# Altium project suntile.PrjPCB
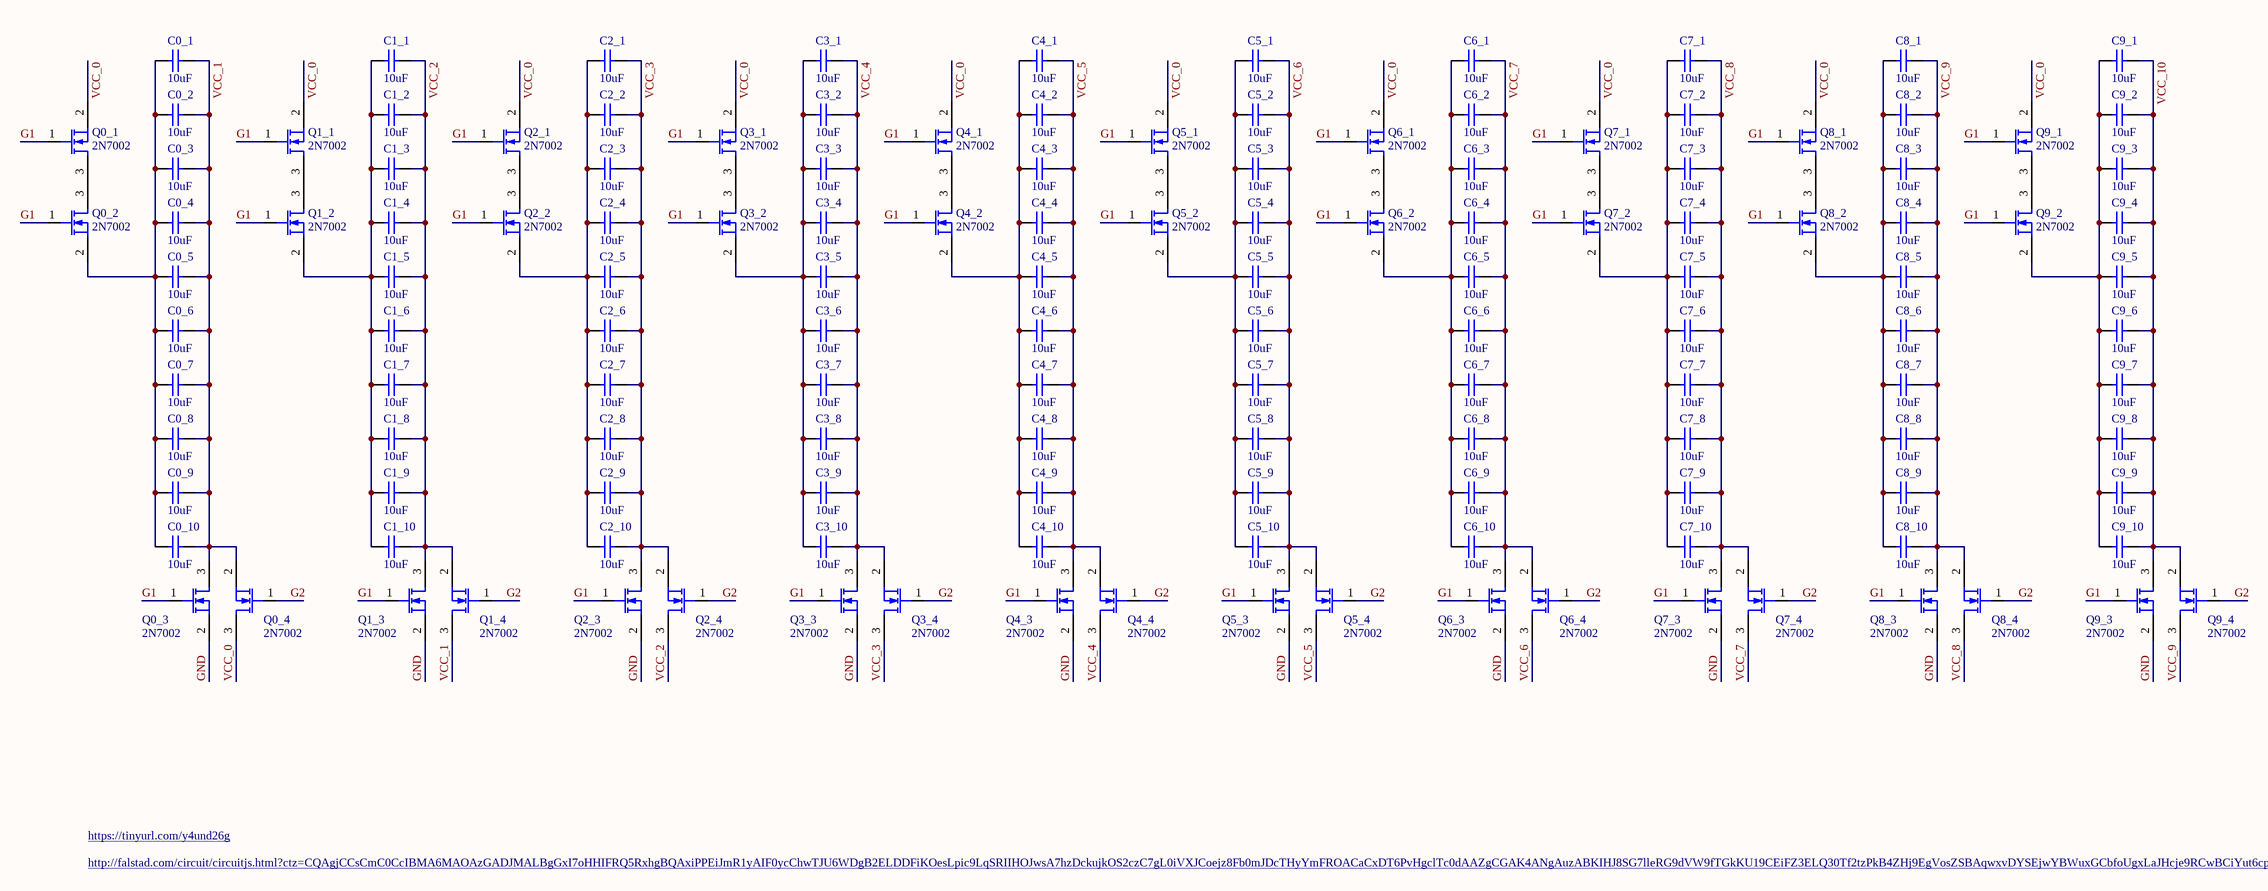
[diagram p0: suntile.SchDoc]
1 sheet, 140 parts. Net scope: global (net labels, ports and power ports of the same name join across sheets).
Board file: suntile.PcbDoc

## Sheet suntile.SchDoc
size C

### Parts
C0_1  value 10uF  [C_0402]  (hidden comment: CL05A106MQ5NUNC)
C0_2  value 10uF  [C_0402]  (hidden comment: CL05A106MQ5NUNC)
C0_3  value 10uF  [C_0402]  (hidden comment: CL05A106MQ5NUNC)
C0_4  value 10uF  [C_0402]  (hidden comment: CL05A106MQ5NUNC)
C0_5  value 10uF  [C_0402]  (hidden comment: CL05A106MQ5NUNC)
C0_6  value 10uF  [C_0402]  (hidden comment: CL05A106MQ5NUNC)
C0_7  value 10uF  [C_0402]  (hidden comment: CL05A106MQ5NUNC)
C0_8  value 10uF  [C_0402]  (hidden comment: CL05A106MQ5NUNC)
C0_9  value 10uF  [C_0402]  (hidden comment: CL05A106MQ5NUNC)
C0_10  value 10uF  [C_0402]  (hidden comment: CL05A106MQ5NUNC)
C1_1  value 10uF  [C_0402]  (hidden comment: CL05A106MQ5NUNC)
C1_2  value 10uF  [C_0402]  (hidden comment: CL05A106MQ5NUNC)
C1_3  value 10uF  [C_0402]  (hidden comment: CL05A106MQ5NUNC)
C1_4  value 10uF  [C_0402]  (hidden comment: CL05A106MQ5NUNC)
C1_5  value 10uF  [C_0402]  (hidden comment: CL05A106MQ5NUNC)
C1_6  value 10uF  [C_0402]  (hidden comment: CL05A106MQ5NUNC)
C1_7  value 10uF  [C_0402]  (hidden comment: CL05A106MQ5NUNC)
C1_8  value 10uF  [C_0402]  (hidden comment: CL05A106MQ5NUNC)
C1_9  value 10uF  [C_0402]  (hidden comment: CL05A106MQ5NUNC)
C1_10  value 10uF  [C_0402]  (hidden comment: CL05A106MQ5NUNC)
C2_1  value 10uF  [C_0402]  (hidden comment: CL05A106MQ5NUNC)
C2_2  value 10uF  [C_0402]  (hidden comment: CL05A106MQ5NUNC)
C2_3  value 10uF  [C_0402]  (hidden comment: CL05A106MQ5NUNC)
C2_4  value 10uF  [C_0402]  (hidden comment: CL05A106MQ5NUNC)
C2_5  value 10uF  [C_0402]  (hidden comment: CL05A106MQ5NUNC)
C2_6  value 10uF  [C_0402]  (hidden comment: CL05A106MQ5NUNC)
C2_7  value 10uF  [C_0402]  (hidden comment: CL05A106MQ5NUNC)
C2_8  value 10uF  [C_0402]  (hidden comment: CL05A106MQ5NUNC)
C2_9  value 10uF  [C_0402]  (hidden comment: CL05A106MQ5NUNC)
C2_10  value 10uF  [C_0402]  (hidden comment: CL05A106MQ5NUNC)
C3_1  value 10uF  [C_0402]  (hidden comment: CL05A106MQ5NUNC)
C3_2  value 10uF  [C_0402]  (hidden comment: CL05A106MQ5NUNC)
C3_3  value 10uF  [C_0402]  (hidden comment: CL05A106MQ5NUNC)
C3_4  value 10uF  [C_0402]  (hidden comment: CL05A106MQ5NUNC)
C3_5  value 10uF  [C_0402]  (hidden comment: CL05A106MQ5NUNC)
C3_6  value 10uF  [C_0402]  (hidden comment: CL05A106MQ5NUNC)
C3_7  value 10uF  [C_0402]  (hidden comment: CL05A106MQ5NUNC)
C3_8  value 10uF  [C_0402]  (hidden comment: CL05A106MQ5NUNC)
C3_9  value 10uF  [C_0402]  (hidden comment: CL05A106MQ5NUNC)
C3_10  value 10uF  [C_0402]  (hidden comment: CL05A106MQ5NUNC)
C4_1  value 10uF  [C_0402]  (hidden comment: CL05A106MQ5NUNC)
C4_2  value 10uF  [C_0402]  (hidden comment: CL05A106MQ5NUNC)
C4_3  value 10uF  [C_0402]  (hidden comment: CL05A106MQ5NUNC)
C4_4  value 10uF  [C_0402]  (hidden comment: CL05A106MQ5NUNC)
C4_5  value 10uF  [C_0402]  (hidden comment: CL05A106MQ5NUNC)
C4_6  value 10uF  [C_0402]  (hidden comment: CL05A106MQ5NUNC)
C4_7  value 10uF  [C_0402]  (hidden comment: CL05A106MQ5NUNC)
C4_8  value 10uF  [C_0402]  (hidden comment: CL05A106MQ5NUNC)
C4_9  value 10uF  [C_0402]  (hidden comment: CL05A106MQ5NUNC)
C4_10  value 10uF  [C_0402]  (hidden comment: CL05A106MQ5NUNC)
C5_1  value 10uF  [C_0402]  (hidden comment: CL05A106MQ5NUNC)
C5_2  value 10uF  [C_0402]  (hidden comment: CL05A106MQ5NUNC)
C5_3  value 10uF  [C_0402]  (hidden comment: CL05A106MQ5NUNC)
C5_4  value 10uF  [C_0402]  (hidden comment: CL05A106MQ5NUNC)
C5_5  value 10uF  [C_0402]  (hidden comment: CL05A106MQ5NUNC)
C5_6  value 10uF  [C_0402]  (hidden comment: CL05A106MQ5NUNC)
C5_7  value 10uF  [C_0402]  (hidden comment: CL05A106MQ5NUNC)
C5_8  value 10uF  [C_0402]  (hidden comment: CL05A106MQ5NUNC)
C5_9  value 10uF  [C_0402]  (hidden comment: CL05A106MQ5NUNC)
C5_10  value 10uF  [C_0402]  (hidden comment: CL05A106MQ5NUNC)
C6_1  value 10uF  [C_0402]  (hidden comment: CL05A106MQ5NUNC)
C6_2  value 10uF  [C_0402]  (hidden comment: CL05A106MQ5NUNC)
C6_3  value 10uF  [C_0402]  (hidden comment: CL05A106MQ5NUNC)
C6_4  value 10uF  [C_0402]  (hidden comment: CL05A106MQ5NUNC)
C6_5  value 10uF  [C_0402]  (hidden comment: CL05A106MQ5NUNC)
C6_6  value 10uF  [C_0402]  (hidden comment: CL05A106MQ5NUNC)
C6_7  value 10uF  [C_0402]  (hidden comment: CL05A106MQ5NUNC)
C6_8  value 10uF  [C_0402]  (hidden comment: CL05A106MQ5NUNC)
C6_9  value 10uF  [C_0402]  (hidden comment: CL05A106MQ5NUNC)
C6_10  value 10uF  [C_0402]  (hidden comment: CL05A106MQ5NUNC)
C7_1  value 10uF  [C_0402]  (hidden comment: CL05A106MQ5NUNC)
C7_2  value 10uF  [C_0402]  (hidden comment: CL05A106MQ5NUNC)
C7_3  value 10uF  [C_0402]  (hidden comment: CL05A106MQ5NUNC)
C7_4  value 10uF  [C_0402]  (hidden comment: CL05A106MQ5NUNC)
C7_5  value 10uF  [C_0402]  (hidden comment: CL05A106MQ5NUNC)
C7_6  value 10uF  [C_0402]  (hidden comment: CL05A106MQ5NUNC)
C7_7  value 10uF  [C_0402]  (hidden comment: CL05A106MQ5NUNC)
C7_8  value 10uF  [C_0402]  (hidden comment: CL05A106MQ5NUNC)
C7_9  value 10uF  [C_0402]  (hidden comment: CL05A106MQ5NUNC)
C7_10  value 10uF  [C_0402]  (hidden comment: CL05A106MQ5NUNC)
C8_1  value 10uF  [C_0402]  (hidden comment: CL05A106MQ5NUNC)
C8_2  value 10uF  [C_0402]  (hidden comment: CL05A106MQ5NUNC)
C8_3  value 10uF  [C_0402]  (hidden comment: CL05A106MQ5NUNC)
C8_4  value 10uF  [C_0402]  (hidden comment: CL05A106MQ5NUNC)
C8_5  value 10uF  [C_0402]  (hidden comment: CL05A106MQ5NUNC)
C8_6  value 10uF  [C_0402]  (hidden comment: CL05A106MQ5NUNC)
C8_7  value 10uF  [C_0402]  (hidden comment: CL05A106MQ5NUNC)
C8_8  value 10uF  [C_0402]  (hidden comment: CL05A106MQ5NUNC)
C8_9  value 10uF  [C_0402]  (hidden comment: CL05A106MQ5NUNC)
C8_10  value 10uF  [C_0402]  (hidden comment: CL05A106MQ5NUNC)
C9_1  value 10uF  [C_0402]  (hidden comment: CL05A106MQ5NUNC)
C9_2  value 10uF  [C_0402]  (hidden comment: CL05A106MQ5NUNC)
C9_3  value 10uF  [C_0402]  (hidden comment: CL05A106MQ5NUNC)
C9_4  value 10uF  [C_0402]  (hidden comment: CL05A106MQ5NUNC)
C9_5  value 10uF  [C_0402]  (hidden comment: CL05A106MQ5NUNC)
C9_6  value 10uF  [C_0402]  (hidden comment: CL05A106MQ5NUNC)
C9_7  value 10uF  [C_0402]  (hidden comment: CL05A106MQ5NUNC)
C9_8  value 10uF  [C_0402]  (hidden comment: CL05A106MQ5NUNC)
C9_9  value 10uF  [C_0402]  (hidden comment: CL05A106MQ5NUNC)
C9_10  value 10uF  [C_0402]  (hidden comment: CL05A106MQ5NUNC)
Q0_1  2N7002  [TO-236AB]
Q0_2  2N7002  [TO-236AB]
Q0_3  2N7002  [TO-236AB]
Q0_4  2N7002  [TO-236AB]
Q1_1  2N7002  [TO-236AB]
Q1_2  2N7002  [TO-236AB]
Q1_3  2N7002  [TO-236AB]
Q1_4  2N7002  [TO-236AB]
Q2_1  2N7002  [TO-236AB]
Q2_2  2N7002  [TO-236AB]
Q2_3  2N7002  [TO-236AB]
Q2_4  2N7002  [TO-236AB]
Q3_1  2N7002  [TO-236AB]
Q3_2  2N7002  [TO-236AB]
Q3_3  2N7002  [TO-236AB]
Q3_4  2N7002  [TO-236AB]
Q4_1  2N7002  [TO-236AB]
Q4_2  2N7002  [TO-236AB]
Q4_3  2N7002  [TO-236AB]
Q4_4  2N7002  [TO-236AB]
Q5_1  2N7002  [TO-236AB]
Q5_2  2N7002  [TO-236AB]
Q5_3  2N7002  [TO-236AB]
Q5_4  2N7002  [TO-236AB]
Q6_1  2N7002  [TO-236AB]
Q6_2  2N7002  [TO-236AB]
Q6_3  2N7002  [TO-236AB]
Q6_4  2N7002  [TO-236AB]
Q7_1  2N7002  [TO-236AB]
Q7_2  2N7002  [TO-236AB]
Q7_3  2N7002  [TO-236AB]
Q7_4  2N7002  [TO-236AB]
Q8_1  2N7002  [TO-236AB]
Q8_2  2N7002  [TO-236AB]
Q8_3  2N7002  [TO-236AB]
Q8_4  2N7002  [TO-236AB]
Q9_1  2N7002  [TO-236AB]
Q9_2  2N7002  [TO-236AB]
Q9_3  2N7002  [TO-236AB]
Q9_4  2N7002  [TO-236AB]

### Nets
G1: Q0_1.1(G) Q0_2.1(G) Q0_3.1(G) Q1_1.1(G) Q1_2.1(G) Q1_3.1(G) Q2_1.1(G) Q2_2.1(G) Q2_3.1(G) Q3_1.1(G) Q3_2.1(G) Q3_3.1(G) Q4_1.1(G) Q4_2.1(G) Q4_3.1(G) Q5_1.1(G) Q5_2.1(G) Q5_3.1(G) Q6_1.1(G) Q6_2.1(G) Q6_3.1(G) Q7_1.1(G) Q7_2.1(G) Q7_3.1(G) Q8_1.1(G) Q8_2.1(G) Q8_3.1(G) Q9_1.1(G) Q9_2.1(G) Q9_3.1(G)
G2: Q0_4.1(G) Q1_4.1(G) Q2_4.1(G) Q3_4.1(G) Q4_4.1(G) Q5_4.1(G) Q6_4.1(G) Q7_4.1(G) Q8_4.1(G) Q9_4.1(G)
GND: Q0_3.2(S) Q1_3.2(S) Q2_3.2(S) Q3_3.2(S) Q4_3.2(S) Q5_3.2(S) Q6_3.2(S) Q7_3.2(S) Q8_3.2(S) Q9_3.2(S)
VCC_0: Q0_1.2(S) Q0_4.3(D) Q1_1.2(S) Q2_1.2(S) Q3_1.2(S) Q4_1.2(S) Q5_1.2(S) Q6_1.2(S) Q7_1.2(S) Q8_1.2(S) Q9_1.2(S)
VCC_1: C0_1.1 C0_2.1 C0_3.1 C0_4.1 C0_5.1 C0_6.1 C0_7.1 C0_8.1 C0_9.1 C0_10.1 Q0_3.3(D) Q0_4.2(S) Q1_4.3(D)
VCC_2: C1_1.1 C1_2.1 C1_3.1 C1_4.1 C1_5.1 C1_6.1 C1_7.1 C1_8.1 C1_9.1 C1_10.1 Q1_3.3(D) Q1_4.2(S) Q2_4.3(D)
VCC_3: C2_1.1 C2_2.1 C2_3.1 C2_4.1 C2_5.1 C2_6.1 C2_7.1 C2_8.1 C2_9.1 C2_10.1 Q2_3.3(D) Q2_4.2(S) Q3_4.3(D)
VCC_4: C3_1.1 C3_2.1 C3_3.1 C3_4.1 C3_5.1 C3_6.1 C3_7.1 C3_8.1 C3_9.1 C3_10.1 Q3_3.3(D) Q3_4.2(S) Q4_4.3(D)
VCC_5: C4_1.1 C4_2.1 C4_3.1 C4_4.1 C4_5.1 C4_6.1 C4_7.1 C4_8.1 C4_9.1 C4_10.1 Q4_3.3(D) Q4_4.2(S) Q5_4.3(D)
VCC_6: C5_1.1 C5_2.1 C5_3.1 C5_4.1 C5_5.1 C5_6.1 C5_7.1 C5_8.1 C5_9.1 C5_10.1 Q5_3.3(D) Q5_4.2(S) Q6_4.3(D)
VCC_7: C6_1.1 C6_2.1 C6_3.1 C6_4.1 C6_5.1 C6_6.1 C6_7.1 C6_8.1 C6_9.1 C6_10.1 Q6_3.3(D) Q6_4.2(S) Q7_4.3(D)
VCC_8: C7_1.1 C7_2.1 C7_3.1 C7_4.1 C7_5.1 C7_6.1 C7_7.1 C7_8.1 C7_9.1 C7_10.1 Q7_3.3(D) Q7_4.2(S) Q8_4.3(D)
VCC_9: C8_1.1 C8_2.1 C8_3.1 C8_4.1 C8_5.1 C8_6.1 C8_7.1 C8_8.1 C8_9.1 C8_10.1 Q8_3.3(D) Q8_4.2(S) Q9_4.3(D)
VCC_10: C9_1.1 C9_2.1 C9_3.1 C9_4.1 C9_5.1 C9_6.1 C9_7.1 C9_8.1 C9_9.1 C9_10.1 Q9_3.3(D) Q9_4.2(S)
NetC0_1_2: C0_1.2 C0_2.2 C0_3.2 C0_4.2 C0_5.2 C0_6.2 C0_7.2 C0_8.2 C0_9.2 C0_10.2 Q0_2.2(S)
NetC1_1_2: C1_1.2 C1_2.2 C1_3.2 C1_4.2 C1_5.2 C1_6.2 C1_7.2 C1_8.2 C1_9.2 C1_10.2 Q1_2.2(S)
NetC2_1_2: C2_1.2 C2_2.2 C2_3.2 C2_4.2 C2_5.2 C2_6.2 C2_7.2 C2_8.2 C2_9.2 C2_10.2 Q2_2.2(S)
NetC3_1_2: C3_1.2 C3_2.2 C3_3.2 C3_4.2 C3_5.2 C3_6.2 C3_7.2 C3_8.2 C3_9.2 C3_10.2 Q3_2.2(S)
NetC4_1_2: C4_1.2 C4_2.2 C4_3.2 C4_4.2 C4_5.2 C4_6.2 C4_7.2 C4_8.2 C4_9.2 C4_10.2 Q4_2.2(S)
NetC5_1_2: C5_1.2 C5_2.2 C5_3.2 C5_4.2 C5_5.2 C5_6.2 C5_7.2 C5_8.2 C5_9.2 C5_10.2 Q5_2.2(S)
NetC6_1_2: C6_1.2 C6_2.2 C6_3.2 C6_4.2 C6_5.2 C6_6.2 C6_7.2 C6_8.2 C6_9.2 C6_10.2 Q6_2.2(S)
NetC7_1_2: C7_1.2 C7_2.2 C7_3.2 C7_4.2 C7_5.2 C7_6.2 C7_7.2 C7_8.2 C7_9.2 C7_10.2 Q7_2.2(S)
NetC8_1_2: C8_1.2 C8_2.2 C8_3.2 C8_4.2 C8_5.2 C8_6.2 C8_7.2 C8_8.2 C8_9.2 C8_10.2 Q8_2.2(S)
NetC9_1_2: C9_1.2 C9_2.2 C9_3.2 C9_4.2 C9_5.2 C9_6.2 C9_7.2 C9_8.2 C9_9.2 C9_10.2 Q9_2.2(S)
NetQ0_1_3: Q0_1.3(D) Q0_2.3(D)
NetQ1_1_3: Q1_1.3(D) Q1_2.3(D)
NetQ2_1_3: Q2_1.3(D) Q2_2.3(D)
NetQ3_1_3: Q3_1.3(D) Q3_2.3(D)
NetQ4_1_3: Q4_1.3(D) Q4_2.3(D)
NetQ5_1_3: Q5_1.3(D) Q5_2.3(D)
NetQ6_1_3: Q6_1.3(D) Q6_2.3(D)
NetQ7_1_3: Q7_1.3(D) Q7_2.3(D)
NetQ8_1_3: Q8_1.3(D) Q8_2.3(D)
NetQ9_1_3: Q9_1.3(D) Q9_2.3(D)

### Notes on the sheet
- https://tinyurl.com/y4und26g
- http://falstad.com/circuit/circuitjs.html?ctz=CQAgjCCsCmC0CcIBMA6MAOAzGADJMALBgGxI7oHHIFRQ5RxhgBQAxiPPEiJmR1yAIF0ycChwTJU6WDgB2ELDDFiKOesLpic9LqSRIIHOJwsA7hzDckujkOS2czC7gL0iVXJCoejz8Fb0mJDcTHyYmFROACaCxDT6PvHgclTc0dAAZgCGAK4ANgAuzABKIHJ8SG7lleRG9dVW9fTGkKU19CEiFZ3ELQ30Tf2tzPkB4ZHj9EgVosZSBAqwxvDYSEjwYBWuxGCbfoUgxLaJHcje9RCwBCiYut6cpjr6mEZqOMG66Db4pATr4AkIAyOQKxUOxxEvHoPR4fHoSnKKF2hEwEng3y2izecg+kC+P2UVQBuHoILyRWYENs+G4sNp4EZSmMHmEKhsKnQcngNGMuyQXmC8Dk3nI2kBZKyFPBR1sQm6fHlTIgYBQ+OCYAick1axwpDe-MFkGFoq0ClJwKlYP82m4SshgmEfgs6GUPBwNFSUI9yH8XriNFdSQSNtm9tmDKcFltUCaDsjfomVFhd15ifcvDOqb8AHMQEGeBR85nsy1Q9xobKofDy3D6DHTlGjrNTg7G+nkLMUz6m7CCPBk4rkk2eTRhPRNnb0GWXB6giFAVU687AdVfLgl0qR01jXbkru-GMvFQIp48GkW28FktjN9yJF-vobNr8H4ysfqINz8g6v1qpNhjVfwP3Xb9T0PKYeAXMJ3Ddbh5ikTgkOQlDOA4FAMUgPVIEfCpMAIfCV0nFJgxIvwACd8zdNFA2nd1eQlfx+x8J1KBoYJ4KY5JfGY5cnEIgAvAA3AB7IpshzaAAB0AEcwEMQY1FRLo9hschdEweR6lCBTmAEqiTyLAsaNEYSxMKCTpLktp9OMoy3TY0zRPEyTZPk5hKP9EyvKLL9JA88pjgDQKoV8iUJC4hILkcjiVzsz0gtLZg8zcTomlSqAbGaZLBCBU4MqqYYcuI7N0AHQsGKcPMY2zeIgjCmJAQuQqmovaxLVBSkLE4O0nQ3McnRHexx34XqRBHARK36vj-B65dRwccaApAt0YMEN0WnEdzKI-WK1tizbTDaWcLj2ucoM4iwvJ9bs0yuoLHL7YcAsgVJl1etJqmmMgnDKD7PygN6yHGgZwHg5ogIsf7Kxw9ia3YGq+GhypBHeaR0YkGBYCWVUbEIPUdDK17vjehDzEBliRH+kanEo-6ugpwQ6O+iKobepVYcdJaofsSteMrJtOaVXitzYZsxsZpU7TRjHpCx81bgMAgsL1KxuRw14yapfM6JMkqe0ZYxcWCORsD1XQeWFTXbgxD1iG8HQBxmHBEFJSVOplXR3GSYjHJVRRlEgZFXVWeADFxeAxRxMrjn0EmMUWH03Y66VtZ4ujfEjJl0BQLARWY0gVBUBTxAMZ91mVsVFn0CUU+tSiC0cr3gr8tO4LlOCLkGRRjC2GZUj7vYcHzrQrzLrlNR0PpI4LC1yWtbqmi2KhiJsbnBEzfLknbCxHIZAjuATRfD4EX3meYWJOb+KB7AbOvKViNaWqfy958pd9AgBp-f1BgCIbaHaGB2LQSAetKIdAAoxnDBWMKbtabiwqgggW4Umw1SLCmXywFP57VAQdLBipVqgN8PA9OsEfCZj8hFSivhwK+DXpcKQTFqKTBoQuJsrC7QOQoRfHgQVl7BX4ekK0XVeEiH4ZEKmQweESKgAIPeAghEe0irGPcY4NoBRkeIpOpNkA-XaCZQRth+F-kGODTabQ3CvEIDQA8JkYwThwAAfXQI4pxVgNhOL5Ooe29tIiRzuHHVxJhTCOKUI4pAjjI6OMwO0betht5d1BkMf+kDgHcDiSDOBAVTixVOPQyhThDiqVytMaKQJu6tHwK6IQGgcIYggHyYeuBlBWAkUIaCQI37FBcJNaCWUMqFLBiIDK3FylMngBhLA2AsL2zDmiJc8wtirD1MQPx-YXbKDEZ04R3SjhpL2Ygqq5wfBwTDBtCixyLrgF6eDROVCDl7SygdQQuJWaXOzDkoKTYZEMh+QIJwABnSwMCaC+0GvUHI+QAXQGAnIoEVgoRsJytxN03EKFvkufQvJiT3CmOaG8Y67yFwcL8ECkqfASoNRAJC6F2s+blT5sOZUqp1CmE4DhVISAVCUDeAKEgxp0DGjZd4b4tcuntE6PYWAmZOYmNoIBNoeZikjX4TTXMQyoB9A1f9MsZRaHJFoei3FYN8UjEOOVTmCKb4MQaciCITTIBolencbw1t7akgFDyLlXJ7aGDnjs7WwMBFyKZVcVoZUtgbJdjhQOChFncjRLiQghAZiWzFQGlw-T4VZQZoCpm1qOBUFlRC7IUKYWUUlWOKm9hKH+E+SIHJSL2AOXKlw8GsgEBXlMF2lgsQ97pX3Ao++xQdo5qyi1XNjELBBsci1Ry8C50Gp9POlB-gYaTSCgeJsi6EjVFzbCiWyrynMEIpkMw0RyIiQAA6yQQt2wYWlDoSCQJgDEkIrCRyTdoEGjVRQIL-XVUQZ6L3XtvcE3t71JqKnKtwYDl6b0yTvSwSxZFOZ2J-pqMAjj4iuMcW4TgQT5KkEgEEiQRH9ChKwxEzD0SAoLRGsKItNbdERTzIxgt7G-1lkogteh7GWosyOfx6o-Gf6-UZgzemWq5XJPMcwES9RMkRHki81QGAQj-BCC+kUL7ZEoA2EQMg9snwPgUnMHgIASgAFEADKAB5AAcgAQQcwAFSkgCgAwk5gACvJ8AgZLjrEjvmXOZAiREGVneEUXbu0QBoIQCzmpLivFeAAcSc65qzHmbMAEk0vOYADI2f85mTJwX4simRMrTUXAVCqRYZgDCVhVlYCqNOHl7USwgB83ZgA6lZkoHncsOYACIAFVPOubsyUfz3J8z1FpK8QDVhc4WbpIgV4vWBtDYBdZvLNnpuzaAA

### Library data of the parts
C0_1-C0_10 C1_1-C1_10 C2_1-C2_10 C3_1-C3_10 C4_1-C4_10 C5_1-C5_10 C6_1-C6_10 C7_1-C7_10 C8_1-C8_10 C9_1-C9_10 = CL05A106MQ5NUNC: C - CAPACITOR - MLCC - 10uF - 6.3V - 0402; WVDC: 6.3; LCSC Part #: C15525; JLC Availability: Basic
Q0_1-Q0_4 Q1_1-Q1_4 Q2_1-Q2_4 Q3_1-Q3_4 Q4_1-Q4_4 Q5_1-Q5_4 Q6_1-Q6_4 Q7_1-Q7_4 Q8_1-Q8_4 Q9_1-Q9_4 = 2N7002: Q - TRANSISTOR - MOSFET (N) - 60V - 200mW; WVDC: 60; JLC Availability: Basic; LCSC Part #: C8545